# Altium schematic sheet SquidPage.SchDoc
size A; DocumentNumber: 2; SheetNumber: 2; SheetTotal: 2
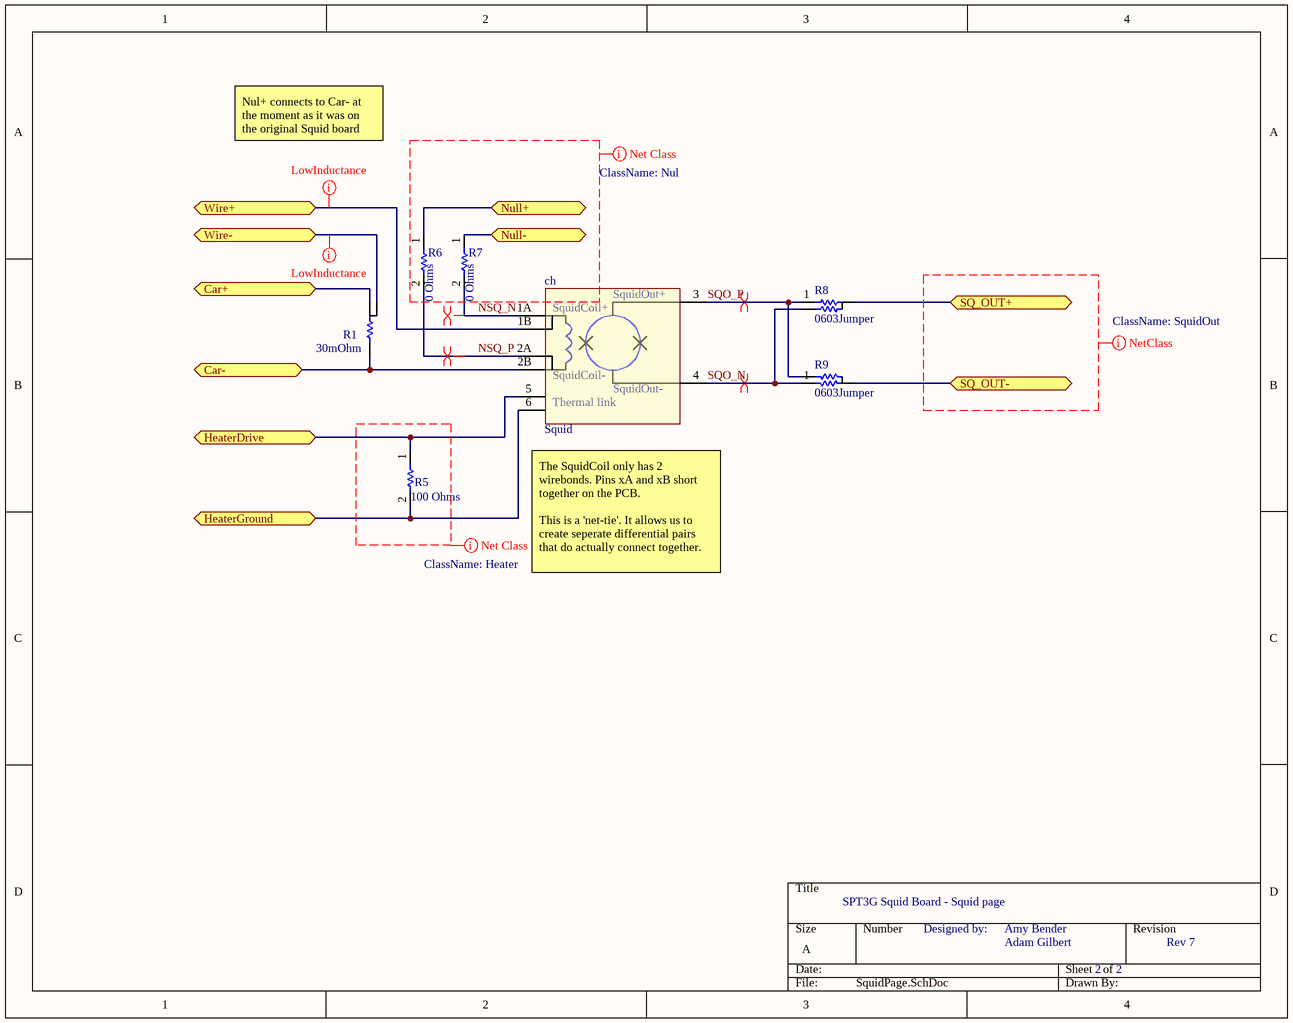
[diagram p0: SquidPage.SchDoc]

## Parts
ch  Squid  [Squid2]  (no BOM)
R1  value 30mOhm  [0805NetTie]  (hidden comment: ResBias)  (net tie)
R5  value 100 Ohms  [0603-NoSilk]  (hidden comment: ResSquidBoard)
R6  value 0 Ohms  [0603]  (hidden comment: ResSquidBoard)
R7  value 0 Ohms  [0603]  (hidden comment: ResSquidBoard)
R8  0603Jumper  [0603-jumper]
R9  0603Jumper  [0603-jumper]

## Ports
Car+, Car-, HeaterDrive, HeaterGround, Null+, Null-, SQ_OUT+, SQ_OUT-, Wire+, Wire-

## Nets
Car+: R1.2A ; port Car+
Car-: ch.2B(SquidCoil-) R1.1 ; port Car-
HeaterDrive: ch.5(Heater) R5.1 ; port HeaterDrive
HeaterGround: ch.6(HeaterGnd) R5.2 ; port HeaterGround
NSQ_N: ch.1A(SquidCoil+) R7.2
NSQ_P: ch.2A(SquidCoil-) R6.2
Null+: R6.1 ; port Null+
Null-: R7.1 ; port Null-
SQ_OUT+: R8.2 ; port SQ_OUT+
SQ_OUT-: R9.2 ; port SQ_OUT-
SQO_N: ch.4(SQUID-) R8.3 R9.1
SQO_P: ch.3(SQUID+) R8.1 R9.3
Wire+: ch.1B(SquidCoil+) ; port Wire+
Wire-: R1.2B ; port Wire-

## Layout directives
net class Heater: (no net found under the mark)
net class Nul: (no net found under the mark)
net class LowInductance: Wire+, Wire-
differential pair: NSQ_N, NSQ_P, SQO_N, SQO_P
net class SquidOut: (no net found under the mark)

## Notes on the sheet
- Nul+ connects to Car- at the moment as it was on the original Squid board
- (near ch) The SquidCoil only has 2 wirebonds. Pins xA and xB short together on the PCB.
  This is a 'net-tie'. It allows us to create seperate differential pairs that do actually connect together.
- SPT3G Squid Board - Squid page
- Designed by:
- Adam Gilbert
- Amy Bender
- 2     2
- Rev 7
- (in symbol Squid) SquidOut+; SquidOut-; Thermal link

## Library data of the parts
R1 = ResBias: Resistor
R5-R7 = ResSquidBoard: Resistor
R8 R9 = 0603Jumper: RES 1 OHM 1/10W 1% 0603 SMD; Value: 1; TechInfo: *